# EAGLE design source_eagle (EAGLE 9.6.2)
COMPANY: ADAFRUIT INDUSTRIES; DRAWN: KTOWN; REV: A
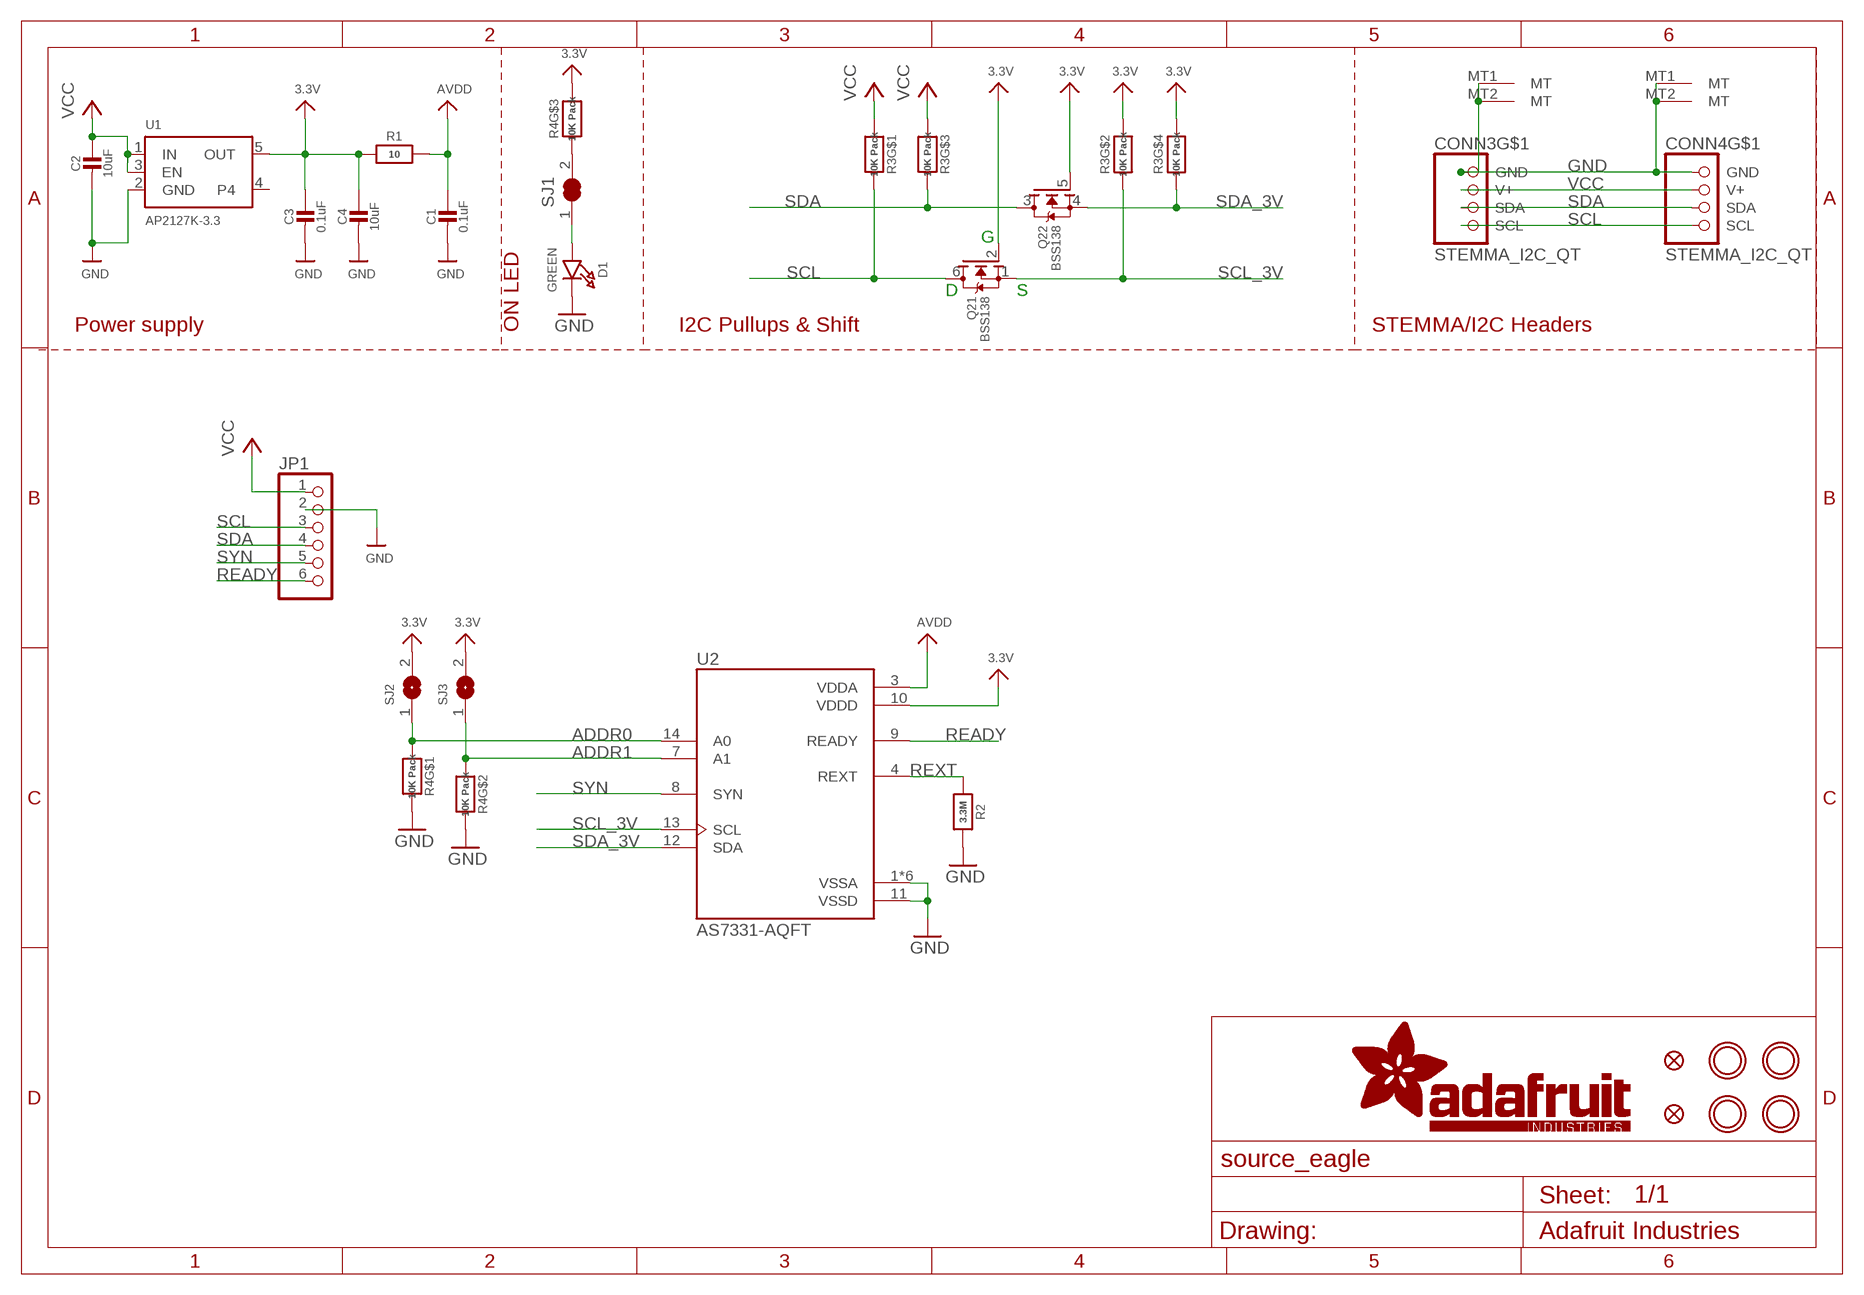
[diagram p0: schematic, sheet 1]

## Parts
C1  0.1uF  CAP_CERAMIC0603_NO  [0603-NO]
C2  10uF  CAP_CERAMIC0805-NOOUTLINE  [0805-NO]
C3  0.1uF  CAP_CERAMIC0603_NO  [0603-NO]
C4  10uF  CAP_CERAMIC0805-NOOUTLINE  [0805-NO]
CONN3  STEMMA_I2C_QT  [JST_SH4]
CONN4  STEMMA_I2C_QT  [JST_SH4]
D1  GREEN  LED0603_NOOUTLINE  [CHIPLED_0603_NOOUTLINE]
FID3  FIDUCIAL_0.5MM  [FIDUCIAL_0.5MM]
FID4  FIDUCIAL_0.5MM  [FIDUCIAL_0.5MM]
JP1  HEADER-1X670MIL  [1X06_ROUND_70]
Q2  BSS138  MOSFET-N_DUAL  [SOT363]
R1  10  RESISTOR_0603_NOOUT  [0603-NO]
R2  3.3M  RESISTOR_0603_NOOUT  [0603-NO]
R3  10K Pack  RESISTOR_4PACK  [RESPACK_4X0603]
R4  10K Pack  RESISTOR_4PACK  [RESPACK_4X0603]
SJ1  SOLDERJUMPER_CLOSED  [SOLDERJUMPER_CLOSEDWIRE]
SJ2  SOLDERJUMPER  [SOLDERJUMPER_ARROW_NOPASTE]
SJ3  SOLDERJUMPER  [SOLDERJUMPER_ARROW_NOPASTE]
U1  AP2127K-3.3  VREG_SOT23-5  [SOT23-5]
U2  AS7331-AQFT  [AS7331_SNAP]
U$1  MOUNTINGHOLE2.5  [MOUNTINGHOLE_2.5_PLATED]
U$17  MOUNTINGHOLE2.5  [MOUNTINGHOLE_2.5_PLATED]
U$19  MOUNTINGHOLE2.5  [MOUNTINGHOLE_2.5_PLATED]
U$21  MOUNTINGHOLE2.5  [MOUNTINGHOLE_2.5_PLATED]

## Nets
3.3V: C3.1 C4.1 Q2.2(1:G) Q2.5(2:G) R1.1 R3.2 R3.4 R4.6 SJ2.2 SJ3.2 U1.5(OUT) U2.10(VDDD)
ADDR0: R4.1 SJ2.1 U2.14(A0)
ADDR1: R4.2 SJ3.1 U2.7(A1)
AVDD: C1.1 R1.2 U2.3(VDDA)
GND [highpower]: C1.2 C2.2 C3.2 C4.2 CONN3.1(GND) CONN3.MT1(MT) CONN3.MT2(MT) CONN4.1(GND) CONN4.MT1(MT) CONN4.MT2(MT) D1.C JP1.2 R2.2 R4.7 R4.8 U1.2(GND) U2.1(VSSA) U2.2(VSSA) U2.5(VSSA) U2.6(VSSA) U2.11(VSSD) U2.15(VSSA) U2.16(VSSA)
N$1: D1.A SJ1.1
N$2: R4.3 SJ1.2
READY: JP1.6 U2.9(READY)
REXT: R2.1 U2.4(REXT)
SCL: CONN3.4(SCL) CONN4.4(SCL) JP1.3 Q2.6(1:D) R3.8
SCL_3V: Q2.1(1:S) R3.7 U2.13(SCL)
SDA: CONN3.3(SDA) CONN4.3(SDA) JP1.4 Q2.3(2:D) R3.6
SDA_3V: Q2.4(2:S) R3.5 U2.12(SDA)
SYN: JP1.5 U2.8(SYN)
VCC [highpower]: C2.1 CONN3.2(V+) CONN4.2(V+) JP1.1 R3.1 R3.3 U1.1(IN) U1.3(EN)
Unconnected: R4.4 R4.5 U1.4

## Notes on the sheet
- G
- D | S
- Power supply | ON LED | I2C Pullups & Shift | STEMMA/I2C Headers

## Library data of the parts
C1-C4 = microbuilder:CAP_CERAMIC: Ceramic Capacitors For new designs, use the packages preceded by an '_' character since they are more reliable: The following footprints should be used on most boards: _0402 - Standard footprint for regular board layouts _0603 - Standard footprint for regular board layouts _0805 - Standard footprint for regular board layouts _1206 - Standard footprint for regular board layouts For extremely tight-pitch boards where space is at a premium, the following 'micro-pitch' footprints can be used (smaller pads, no silkscreen outline, etc.): _0402MP - Micro-pitch footprint for very dense/compact boards _0603MP - Micro-pitch footprint for very dense/compact boards _0805MP - Micro-pitch footprint for very dense/compact boards _1206MP - Micro-pitch footprint for very dense/compact boards
CONN3 CONN4 = adafruit_electromech:STEMMA_I2C; LCSC: C2845363
D1 = microbuilder:LED: LED 0603 - 0603 Surface Mount Package 2mA: Green LED - Low Power (3.9mcd, 2ma, 1.7Vf) - Digikey: 475-2709-2-ND Orange LED - Low Power (9.8mcd, 2ma, 1.8Vf) - Digikey: 475-1194-2-ND Red LED - Low Power (5mcd, 2ma, 1.8Vf) - Digikey: 475-1195-2-ND Yellow LED - Low Power (7mcd, 2ma, 1.8Vf) - Digikey: 475-1196-2-ND 5mA: Blue LED - Low Power (17mcd, 5ma, 2.9Vf) - Digikey: LNJ937W8CRACT-ND 0805 - 0805 Surface Mount Package 2mA: Red LED (8.8mcd, 2mA, 1.8Vf, Clear) - Low Power [Digikey: 475-2510-1-ND] Green LED (5mcd, 2mA, 1.8Vf, Clear) - Low Power [Digikey: 475-2730-1-ND] Yellow LED (11.3mcd, 2mA, 1.8Vf, Clear) - Low Power [Digikey: 475-2555-1-ND] 20mA: Red LED (104mcd, 20mA, Diffused) - LS R976 [Digikey: 475-1278-6-ND] Red LED (12mcd, 20mA, 2.0Vf, Clear) - APT2012EC [Digikey: 754-1128-1-ND] Green LED (15mcd, 20mA, 2.2Vf, Clear) - APT2012GC [Digikey: 754-1131-1-ND] Orange LED (160mcd, 20mA, 2.1Vf, Clear) - APT2012SECK [Digikey: 754-1130-1-ND] 1206 - 1206 Surface Mount Package Green LED (26mcd, 20mA, Diffused) - LG N971 [Digikey: 475-1407-6-ND] Red LED (15mcd, 20mA, Diffused) - LH N974 [Digikey: 475-1416-6-ND] Cree - Cree High-Power Surface Mount LEDs XPEBWT-L1-0000-00D50 - White 111lm 350mA 2.9Vf 6200K 110° XTEAWT-00-0000-00000LEE3 - White 114lm 350mA 2.85Vf 5000K 115° Everlight - Everlight 45-21 Series Surface Mount LEDs 45-21/QK2C-B2832AC2CB2/2T - Warm White 2000mcd 20mA 3.25Vf 3050K 120° 45-21/LK2C-B38452C4CB2/2T - Nuetral White 2000mcd 20mA 3.25Vf 4150K 120° 45-21/LK2C-B50634C6CB2/2T - Cold White 2200mcd 20mA 3.25Vf 5650K 120° PLCC2 Reverse Mount LS T77K-J1L2-1-0-2-R18-Z - Red 11.25mcd 2mA 1.8Vf 630nm 120° LO T77K-L1M2-24-Z - Orange 19.6mcd 2mA 1.8Vf 606nm 120° LY T77K-K2M1-26-Z - Yellow 15.7mcd 2mA 1.8Vf 587nm 120°; ROT: 270
FID3 FID4 = microbuilder:FIDUCIAL: Fiducial Alignment Points Various fiducial points for machine vision alignment.
JP1 = microbuilder:HEADER-1X6: PIN HEADER
Q2 = microbuilder:MOSFET-N_DUAL: Dual N-Channel MOSFET SOT363 (2.0x1.25mm) 2N7002PS - 60V, 320mA [Digikey: 568-5984-1-ND]; JLC_ROTATION: 270
R1 R2 = microbuilder:RESISTOR: Resistors For new designs, use the packages preceded by an '_' character since they are more reliable: The following footprints should be used on most boards: _0402 - Standard footprint for regular board layouts _0603 - Standard footprint for regular board layouts _0805 - Standard footprint for regular board layouts _1206 - Standard footprint for regular board layouts For extremely tight-pitch boards where space is at a premium, the following 'micro-pitch' footprints can be used (smaller pads, no silkscreen outline, etc.): _0402MP - Micro-pitch footprint for very dense/compact boards _0603MP - Micro-pitch footprint for very dense/compact boards _0805MP - Micro-pitch footprint for very dense/compact boards _1206MP - Micro-pitch footprint for very dense/compact boards
R3 R4 = microbuilder:RESISTOR_4PACK: Resistor Packs (4 resistors) 4 x 0603 10K 1/16W - Digikey: YC164J-10KCT-ND
SJ1 = microbuilder:SOLDERJUMPER_CLOSED: Solder Jumper - Closed These solder jumpers are closed by default CLOSEDWIRE - 10 mil trace between pads that can be cut and resoldered later CLOSEDPERM - 63 mil trace between pads for a permanent connection (used to 'bridge' two signals, a shameless hack for Eagle). Can double as a test point as well (no cream layer)
SJ2 SJ3 = microbuilder:SOLDERJUMPER: SMD Solder JUMPER Solder the two pads together to create a connection, or remove the solder to break it. REFLOW - Use this footprint for solder paste and reflow ovens. WAVE - Use this footprint for hand-soldering (larger pads). CLOSED - Has a trace between the two pads to ensure it is closed by default. The trace needs to be cut to disable the jumper, and can be closed again by creating a solder bridge between the two pads.; BOM: EXCLUDE
U1 = adafruit_power:VREG_SOT23-5: SOT23-5 Fixed Voltage Regulators Part Current Out V Out V In V Dropout θJA (°C/W) TJ (°C) Digikey Part No. ADP121 150mA 3.3V 3.4-5.5V 0.09V @ 150mA -- -- ADP121-AUJZ33R7CT-ND ADP121 150mA 3.0V 3.1-5.5V 0.09V @ 150mA -- -- ADP121-AUJZ30R7CT-ND ADP122 300mA 3.3V 3.4-5.5V 0.085V @ 300mA -- -- ADP122AUJZ-3.3-R7CT-ND ADP1712 300mA 3.3V 3.5-5.5V 0.17V @ 300mA -- -- ADP1712AUJZ-3.3-R7TR-ND AP7311 (Low Cost) 150mA 3.3V 3.5-6V 0.15V @ 150mA -- -- AP7311-33WG-7DICT-ND LD39015M18R 150mA 1.8V 1.9V-5.5V 0.08V @ 100mA -- -- 497-6977-1-ND LP2985A-33DBVR 150mA 3.3V 3.3-16V 0.28V @ 150mA 206 150 296-18479-1-ND MCP1824T-3302E/OT 300mA 3.3V 3.5V-6V 0.2V @ 300mA -- -- MCP1824T-3302E/OTCT-ND MIC5205-2.5YM5 TR 150mA 2.5V 2.7-16V 0.165V @ 150mA -- -- 576-1257-2-ND MIC5205-3.0YM5 TR 150mA 3.0V 3.2V-16V 0.165V @ 150mA -- -- 576-1258-2-ND MIC5205-3.3YM5 TR 150mA 3.3V 3.5V-16V 0.165V @ 150mA -- -- 576-1259-2-ND TPS780330220 150mA 3.3V+2.2V 3.6-5.5V 250mV Max -- -- 296-23332-1-ND TDA3663/N1,135 100mA 3.3V 3.5-45V 0.18V @ 50mA -- -- 568-5343-1-ND Max operating temp can be calculated using θJA, TJ (max junction temperature), and power in watts. Set the "Maximum Ambient Temperature" until it reaches TJ ("Max Junction Temperature"), which is the absolute limit for safe use of the regulator: Heat Sink Temperature Calculator <http://www.daycounter.com/Calculators/Heat-Sink-Temperature-Calculator.phtml> For example, With 12V source into a 3.3V LP2985 and a 30mA load, we are dissipating (12V-3.3V) * 0.03A = 0.261W. With a θJA of 206 °C/W, a TJ of 150°C, and 261mW we can safely use the chip without a heat sink up to 75°C (=147.1°C Junction Temperature).; JLC_ROTATION: 270
U2 = adafruit_sensor:AS7331-AQFT: Check availability <https://pricing.snapeda.com/parts/AS7331-AQFT/ams%20OSRAM/view-part?ref=eda>; AVAILABILITY: In Stock; CHECK_PRICES: https://www.snapeda.com/parts/AS7331-AQFT/ams/view-part/?ref=eda; DESCRIPTION: Ambient Light Sensors AS7331 3channel UV-A/B/C spectral sensor IC; MF: ams OSRAM; MP: AS7331-AQFT; PACKAGE: None; PRICE: None; SNAPEDA_LINK: https://www.snapeda.com/parts/AS7331-AQFT/ams/view-part/?ref=snap
U$1 U$17 U$19 U$21 = adafruit_electromech:MOUNTINGHOLE: Mounting Hole For #2 screws (0.086"/2.18mm width, 0.094"/2.4mm hole) use 2.5mm; BOM: EXCLUDE

## Net classes
1 highpower: width 0.305 mm, drill 0.483 mm
2 lowpower: width 0.254 mm, drill 0.483 mm

## Board
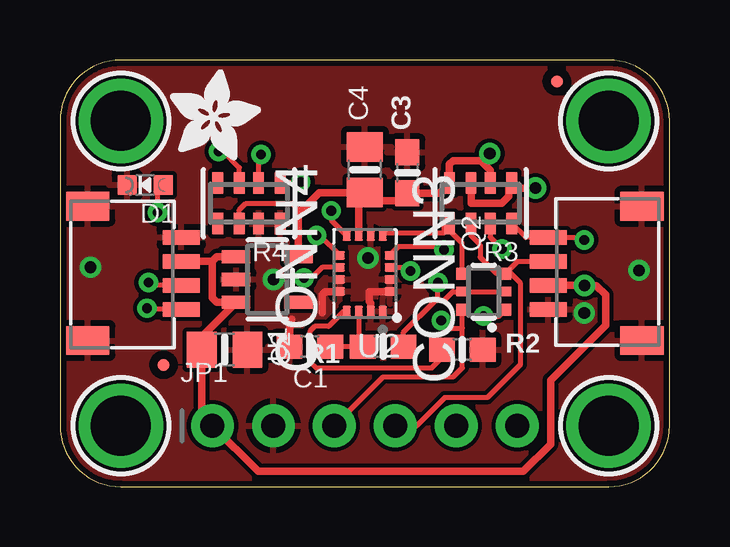
[diagram p1: board, top side]
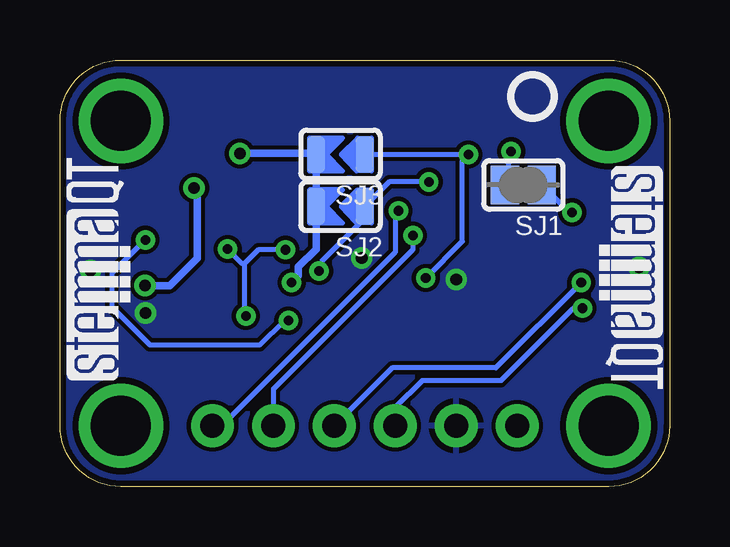
[diagram p2: board, bottom side, seen from below]

Size 25.4 x 17.78 mm. Coordinates in mm from the lower left corner, seen from the top.
Outline: 0,15.24 0,2.54 arc90 2.54,0 22.86,0 arc90 25.4,2.54 25.4,15.24 arc90 22.86,17.78 2.54,17.78 arc90 0,15.24
Copper layers (1*16): Top 0.035mm / dielectric 1.5mm / Bottom 0.035mm
Design rules "adafruit 7-7": minimum track width 7mil, minimum drill 15.5mil, track to track 7mil, track to pad 7mil, pad to pad 7mil, via to via 7mil, smd to smd 7mil, copper to edge 10mil, drill to drill 8mil, minimum pad ring 10mil, minimum via ring 8mil, stop-mask expansion 2mil, vias tented up to drill 20mil, thermal gap 10mil

### Footprints (pad centres in the part's own frame; a part is rotated, then mirrored left to right if it is on the bottom)
0603-NO = smd 1.075 x 1: 1 -0.85,0; 2 0.85,0
0805-NO = smd 1.24 x 1.5: 1 -0.95,0; 2 0.95,0
JST_SH4 = smd 0.6 x 1.55: 1 -1.5,2.006; 2 -0.5,2.006; 3 0.5,2.006; 4 1.5,2.006 | smd 1.2 x 1.8: MT1 -2.8,-1.894; MT2 2.8,-1.894
CHIPLED_0603_NOOUTLINE = smd 0.8 x 0.8: A 0,-0.75; C 0,0.75
FIDUCIAL_0.5MM = smd 0.5 x 0.5: 1 0,0
1X06_ROUND_70 = drill 1 pad 1.778: 1 -6.35,0; 2 -3.81,0; 3 -1.27,0; 4 1.27,0; 5 3.81,0; 6 6.35,0
SOT363 = smd 0.5 x 0.5: 1 -0.75,-0.9; 3 0.75,-0.9; 4 0.75,0.9; 6 -0.75,0.9 | smd 0.4 x 0.5: 2 0,-0.9; 5 0,0.9
RESPACK_4X0603 = smd 0.45 x 0.9: 1 -1.3,-0.85; 2 -0.4,-0.85; 3 0.4,-0.85; 4 1.3,-0.85; 5 1.3,0.85; 6 0.4,0.85; 7 -0.4,0.85; 8 -1.3,0.85
SOLDERJUMPER_CLOSEDWIRE = smd 1.168 x 1.6: 1 -0.762,0; 2 0.762,0 | smd 0.635 x 0.203: WIRE 0,0
SOLDERJUMPER_ARROW_NOPASTE = smd 0.762 x 1.524: 1 -1.016,0; 2 1.016,0
SOT23-5 = smd 0.55 x 1.2: 1 -0.95,-1.3; 2 0,-1.3; 3 0.95,-1.3; 4 0.95,1.3; 5 -0.95,1.3
AS7331_SNAP = smd 0.35 x 0.44: 1 -0.75,1.57; 2 -0.25,1.57; 3 0.25,1.57; 4 0.75,1.57; 9 0.75,-1.57; 10 0.25,-1.57; 11 -0.25,-1.57; 12 -0.75,-1.57 | smd 0.44 x 0.35: 5 1.045,0.75; 6 1.045,0.25; 7 1.045,-0.25; 8 1.045,-0.75; 13 -1.045,-0.75; 14 -1.045,-0.25; 15 -1.045,0.25; 16 -1.045,0.75
MOUNTINGHOLE_2.5_PLATED = drill 2.5 pad 3.2: P$1 0,0

### Placement (x,y rotation side)
C1  10.41,5.84 180 top
C2  6.86,5.71 0 top
C3  14.48,13.08 90 top
C4  12.7,13.21 90 top
CONN3  22.35,8.89 90 top
CONN4  3.05,8.89 270 top
D1  3.56,12.57 90 top
FID3  20.7,16.89 0 top
FID4  4.32,5.08 0 top
JP1  12.7,2.54 0 top
PLABEL0  [PLABEL0]  6.35,0.89 0 top
PLABEL1  [PLABEL1]  8.89,4.19 0 top
PLABEL2  [PLABEL2]  11.43,0.89 0 top
PLABEL3  [PLABEL3]  13.97,4.19 0 top
PLABEL8  [PLABEL8]  0.51,12.45 0 top
PLABEL11  [PLABEL11]  12.7,0.89 0 bottom
PLABEL14  [PLABEL14]  8.51,12.45 270 bottom
PLABEL15  [PLABEL15]  9.27,15.24 0 top
PLABEL16  [PLABEL16]  19.18,4.19 0 top
PLABEL17  [PLABEL17]  16.64,0.89 0 top
PLABEL18  [PLABEL18]  10.03,14.1 0 top
PLABEL19  [PLABEL19]  18.03,14.22 0 top
PLABEL20  [PLABEL20]  16.13,10.92 90 bottom
PLABEL21  [PLABEL21]  16.13,13.08 90 bottom
PLABEL22  [PLABEL22]  12.7,16.26 0 bottom
PLABEL23  [PLABEL23]  12.7,5.59 0 bottom
PLABEL24  [PLABEL24]  13.21,9.27 0 bottom
Q2  17.65,8.13 90 top
R1  13.46,5.84 180 top
R2  16.76,5.71 0 top
R3  17.53,11.81 180 top
R4  7.87,11.81 180 top
SJ1  6.1,12.57 180 bottom
SJ2  13.72,11.68 180 bottom
SJ3  13.72,13.84 180 bottom
U1  8.64,8.64 270 top
U2  12.7,8.89 180 top
U$1  2.54,15.24 0 top
U$17  22.86,15.24 0 top
U$19  2.54,2.54 0 top
U$21  22.86,2.54 0 top
U$22  [ADAFRUIT_3.5MM]  4.57,13.59 0 top
U$25  [PCBFEAT-REV-040]  5.71,16.26 0 bottom
U$30  [STEMMAQT]  22.48,4.45 90 bottom
U$31  [STEMMAQT]  2.92,13.34 270 bottom

### Tracks (layer width: path | path; a pad name or v marks a point on that pad's centre or on a via)
3.3V  (via drill 0.4, 0.48)
  Top 0.203: Q2.2 Q2.5 16.37,8.13 15.99,7.75 15.63,7.75 | R4.6 7.47,11.54 7.75,11.81 9.65,11.81 10,11.46 | R1.1 14.31,6.43 15.63,7.75 | 15.63,7.75 15.75,7.87 v15.75,8.51
  Top 0.305: U1.5 9.94,11.4 10,11.46 10.79,12.26 C4.1 13.05,11.91 | U2.10 12.45,11.91 13.05,11.91 | 13.05,11.91 14.15,11.91 C3.1 15.8,12.23 R3.4 16.23,13.43 16.38,13.59 17.53,13.59 | 17.53,13.59 17.93,13.19 R3.2 | 17.53,13.59 17.61,13.59 v17.91,13.89
  Bottom 0.305: v15.75,8.51 15.46,8.79 15.46,9.17 14.73,9.9 SJ2.2 SJ3.2 14.78,13.89 v17.91,13.89
ADDR0  (via drill 0.4)
  Top 0.203: U2.14 14.45,9.14 v14.61,8.99 | v10.03,12.7 9.99,12.66 R4.1
  Bottom 0.203: v14.61,8.99 14.51,8.99 14.51,9.37 12.7,11.18 SJ2.1 11.68,12.7 v10.03,12.7
ADDR1  (via drill 0.4)
  Top 0.203: U2.7 10.92,9.14 10.47,8.69 v10.16,8.69 | v8.38,13.84 8.26,13.84 8.26,12.68 R4.2
  Bottom 0.203: v10.16,8.69 8.64,10.22 8.64,13.59 v8.38,13.84 SJ3.1
AVDD
  Top 0.203: C1.1 R1.2 12.45,5.84 U2.3
GND  (via drill 0.48)
  Top 0.305: U2.16 13.73,8.13 12.88,8.13 12.88,7.72 12.96,7.65 U2.2 | U2.5 11.64,8.13 11.05,8.13 10.92,8 10.92,7.24 | 9.65,6.99 9.56,6.9 C1.2
  other vias: 12.83,9.53 8.89,8.64 1.27,9.14 24.13,9.02 21.84,7.24
  pour Top: 0,17.78 25.4,17.78 25.4,0 0,0
  pour Bottom: 0,17.78 25.4,17.78 25.4,0 0,0
N$1  (via drill 0.4)
  Top 0.203: v4.06,11.43 4.06,12.33 D1.A
  Bottom 0.203: SJ1.1 4.19,11.43 v4.06,11.43
N$2  (via drill 0.4)
  Top 0.203: R4.3 7.47,13.3 6.8,13.97 v6.6,13.97
  Bottom 0.203: SJ1.2 6.86,12.83 6.73,12.95 6.73,13.84 v6.6,13.97
READY  (via drill 0.4)
  Top 0.203: U2.9 11.3,11.11 v11.3,11.5
  Bottom 0.203: v11.3,11.5 11.43,11.37 11.43,9.78 18.67,2.54 JP1.6
REXT
  Top 0.203: U2.4 11.82,7.32 11.19,6.68 10.62,6.68 10.41,6.48 10.41,5.21 10.67,4.95 15.49,4.95 15.91,5.37 R2.1
SCL  (via drill 0.4)
  Top 0.203: R3.8 19.4,10.39 CONN3.4 21.74,10.39 v21.84,10.29 | JP1.3 13.46,4.57 16.38,4.57 16.76,4.95 16.76,6.6 | CONN4.4 3.67,7.39 v3.63,7.44 | Q2.6 16.76,7.37 16.76,6.6 | v15.89,6.92 16.2,6.6 16.76,6.6
  Bottom 0.203: v3.63,7.44 4.01,7.44 7.03,4.42 10.31,4.42 11.43,3.3 JP1.3 | v21.84,10.29 23.24,8.89 23.24,7.49 21.65,5.91 17.08,5.91 16.06,6.92 v15.89,6.92
SCL_3V  (via drill 0.4)
  Top 0.203: U2.13 14.1,10 15.88,10 v16,9.87 | v17.65,7.11 18.29,7.11 Q2.1 | R3.7 17.93,10.39 v18.41,9.91
  Bottom 0.203: v16,9.87 17.14,9.87 17.72,9.3 | v17.65,7.11 17.72,7.18 17.72,9.3 | 17.72,9.3 17.81,9.3 v18.41,9.91
SDA  (via drill 0.4)
  Top 0.203: Q2.3 19.07,9.39 CONN3.3 | Q2.3 18.19,8.88 17.51,9.56 17.51,10.07 17.13,10.45 R3.6 | CONN4.3 3.8,8.39 v3.68,8.51 | JP1.4 14.86,2.54 15.34,3.02 16.03,3.71 17.8,3.71 19.18,5.08 19.18,8.51 18.81,8.88 Q2.3
  Bottom 0.203: v3.68,8.51 7.24,4.95 11.56,4.95 JP1.4
SDA_3V
  Top 0.203: U2.12 13.57,10.58 16,10.58 16,10.9 | R3.5 16,10.96 16,10.9 | Q2.4 16.75,10.15 16,10.9
SYN  (via drill 0.4)
  Top 0.203: U2.8 10.83,10.47 v10.7,10.47
  Bottom 0.203: JP1.5 16.51,4.06 10.7,9.88 v10.7,10.47
VCC  (via drill 0.48)
  Top 0.305: 6.35,9.4 6.35,7.87 6.54,7.69 U1.3 5.91,6.26 C2.1 5.91,2.98 JP1.1 8.26,0.64 19.3,0.64 20.45,1.78 20.45,4.45 22.73,6.73 22.73,8 22.35,8.38 v21.86,8.38 v21.85,8.39 CONN3.2 | 6.35,9.4 6.54,9.59 U1.1 | CONN4.2 5.06,9.4 6.35,9.4 | R3.3 17.13,11.83 17.14,11.81 18.41,11.81 18.7,12.1 18.7,12.45 18.83,12.45 | 18.83,12.45 R3.1 | v19.81,12.45 18.83,12.45
  Bottom 0.305: v21.86,8.38 20.83,8.38 19.68,9.53 19.68,12.32 v19.81,12.45

### Text on the board
Pinguin_tBackup: AS / 7341 | AS7331 | Multi / Spect. / Sensor | UV | Sensor | on | GND | SDA | RDY | INT | VIN | SCL | SYNC | GPIO
Pinguin_bBackup: AS7341 | AS7331 | 10-channel / spectrometer | A1 | LED | A0 | Def. I2C Addr 0x74 | 415,445,480,515nm / 555,590,630,680nm / Clear & Near IR | 260nm,300nm,360nm / Spectral UVA/B/C | Default I2C addr 0x39 | VLogic/Vcc: 3-5VDC